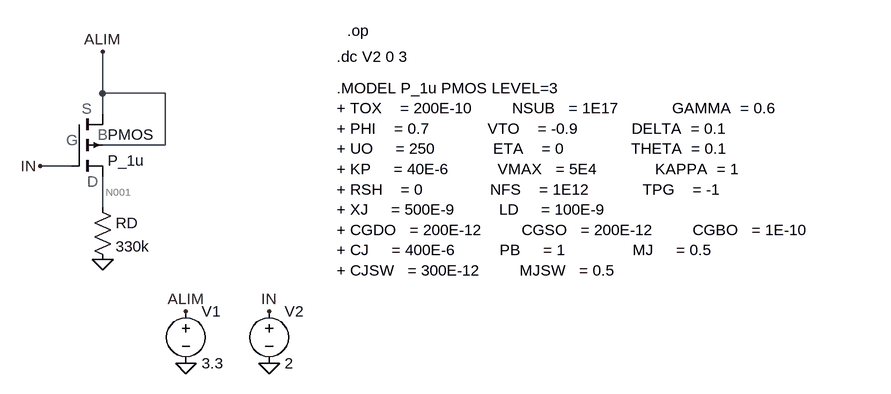
[diagram p0: schematic Gain.asc]
Gain.asc, the LTspice schematic file:
Version 4
SHEET 1 1356 680
WIRE 144 16 144 -48
WIRE 240 16 144 16
WIRE 144 48 144 16
WIRE 240 96 240 16
WIRE 240 96 144 96
WIRE 96 128 48 128
WIRE 144 192 144 144
FLAG 144 272 0
FLAG 144 -48 ALIM
FLAG 48 128 IN
FLAG 272 352 ALIM
FLAG 400 352 IN
FLAG 400 432 0
FLAG 272 432 0
SYMBOL pmos4 96 48 R0
SYMATTR InstName PMOS
SYMATTR Value P_1u
SYMATTR Value2 l=1u w=2.5u
SYMBOL res 128 176 R0
SYMATTR InstName RD
SYMATTR Value 330k
SYMBOL voltage 272 336 R0
WINDOW 123 0 0 Left 0
WINDOW 39 0 0 Left 0
SYMATTR InstName V1
SYMATTR Value 3.3
SYMBOL voltage 400 336 R0
WINDOW 123 0 0 Left 0
WINDOW 39 0 0 Left 0
SYMATTR InstName V2
SYMATTR Value 2
TEXT 112 40 Left 2 ;S
TEXT 504 -40 Left 2 !.dc V2 0 3
TEXT 520 -80 Left 2 !.op
TEXT 504 8 Left 2 !.MODEL P_1u PMOS LEVEL=3\n+ TOX    = 200E-10         NSUB   = 1E17            GAMMA  = 0.6          \n+ PHI    = 0.7             VTO    = -0.9            DELTA  = 0.1          \n+ UO     = 250             ETA    = 0               THETA  = 0.1         \n+ KP     = 40E-6           VMAX   = 5E4             KAPPA  = 1         \n+ RSH    = 0               NFS    = 1E12            TPG    = -1                 \n+ XJ     = 500E-9          LD     = 100E-9               \n+ CGDO   = 200E-12         CGSO   = 200E-12         CGBO   = 1E-10              \n+ CJ     = 400E-6          PB     = 1               MJ     = 0.5                \n+ CJSW   = 300E-12         MJSW   = 0.5
TEXT 120 152 Left 2 ;D
TEXT 88 88 Left 2 ;G
TEXT 136 80 Left 2 ;B

The netlist it stands for:
* Gain.asc
M§PMOS ALIM IN N001 ALIM P_1u l=1u w=2.5u
RD N001 0 330k
V1 ALIM 0 3.3
V2 IN 0 2
.model NMOS NMOS
.model PMOS PMOS
.lib standard.mos
* S
.dc V2 0 3
.op
.MODEL P_1u PMOS LEVEL=3
+ TOX    = 200E-10         NSUB   = 1E17            GAMMA  = 0.6
+ PHI    = 0.7             VTO    = -0.9            DELTA  = 0.1
+ UO     = 250             ETA    = 0               THETA  = 0.1
+ KP     = 40E-6           VMAX   = 5E4             KAPPA  = 1
+ RSH    = 0               NFS    = 1E12            TPG    = -1
+ XJ     = 500E-9          LD     = 100E-9
+ CGDO   = 200E-12         CGSO   = 200E-12         CGBO   = 1E-10
+ CJ     = 400E-6          PB     = 1               MJ     = 0.5
+ CJSW   = 300E-12         MJSW   = 0.5
* D
* G
* B
.backanno
.end

* Results of the author's LTspice run, read from the files saved beside the schematic
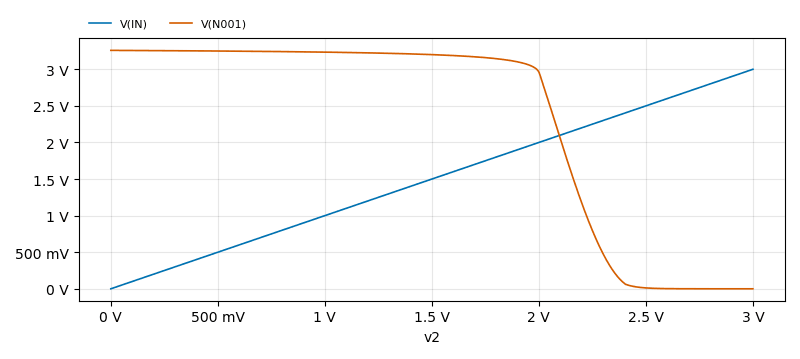
[diagram p1: DC transfer characteristic of Gain.asc, plotted from the saved traces]
* DC transfer characteristic, 1 run:
*   V(IN): 0 V at v2=0 V, 3 V at v2=3 V, min 0 V, max 3 V
*   V(N001): 3.259 V at v2=0 V, 4.323 µV at v2=3 V, min 4.323 µV, max 3.259 V